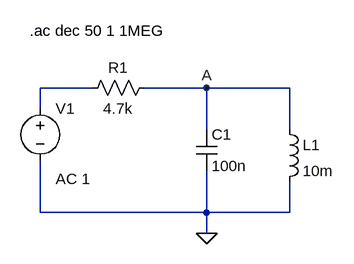
[diagram p0: schematic Draft3.asc]
Draft3.asc, the LTspice schematic file:
Version 4
SHEET 1 880 680
WIRE 128 16 48 16
WIRE 304 16 208 16
WIRE 432 16 304 16
WIRE 48 48 48 16
WIRE 304 80 304 16
WIRE 432 80 432 16
WIRE 48 208 48 128
WIRE 304 208 304 144
WIRE 304 208 48 208
WIRE 432 208 432 160
WIRE 432 208 304 208
WIRE 304 240 304 208
FLAG 304 240 0
FLAG 304 16 A
SYMBOL res 224 0 R90
WINDOW 0 0 56 VBottom 2
WINDOW 3 32 56 VTop 2
SYMATTR InstName R1
SYMATTR Value 4.7k
SYMBOL voltage 48 32 R0
WINDOW 123 24 124 Left 2
WINDOW 39 0 0 Left 0
SYMATTR InstName V1
SYMATTR Value ""
SYMATTR Value2 AC 1
SYMBOL cap 288 80 R0
SYMATTR InstName C1
SYMATTR Value 100n
SYMBOL ind 416 64 R0
SYMATTR InstName L1
SYMATTR Value 10m
SYMATTR SpiceLine Rser=40
TEXT 32 -72 Left 2 !.ac dec 50 1 1MEG

The netlist it stands for:
* Draft3.asc
R1 A N001 4.7k
V1 N001 0 AC 1
C1 A 0 100n
L1 A 0 10m Rser=40
.ac dec 50 1 1MEG
.backanno
.end

* Results of the author's LTspice run, read from the files saved beside the schematic
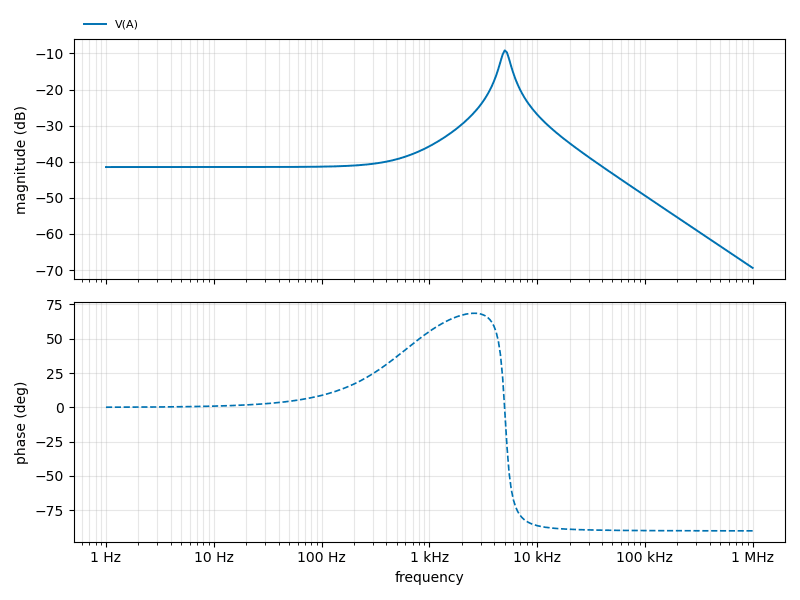
[diagram p1: AC Analysis of Draft3.asc, plotted from the saved traces]
* AC Analysis, 1 run:
*   V(A): -41.47 dB at 1 Hz, -69.41 dB at 1 MHz, peak -9.15 dB at 5.012 kHz, 3 dB below the peak at 4.586 kHz and 5.568 kHz